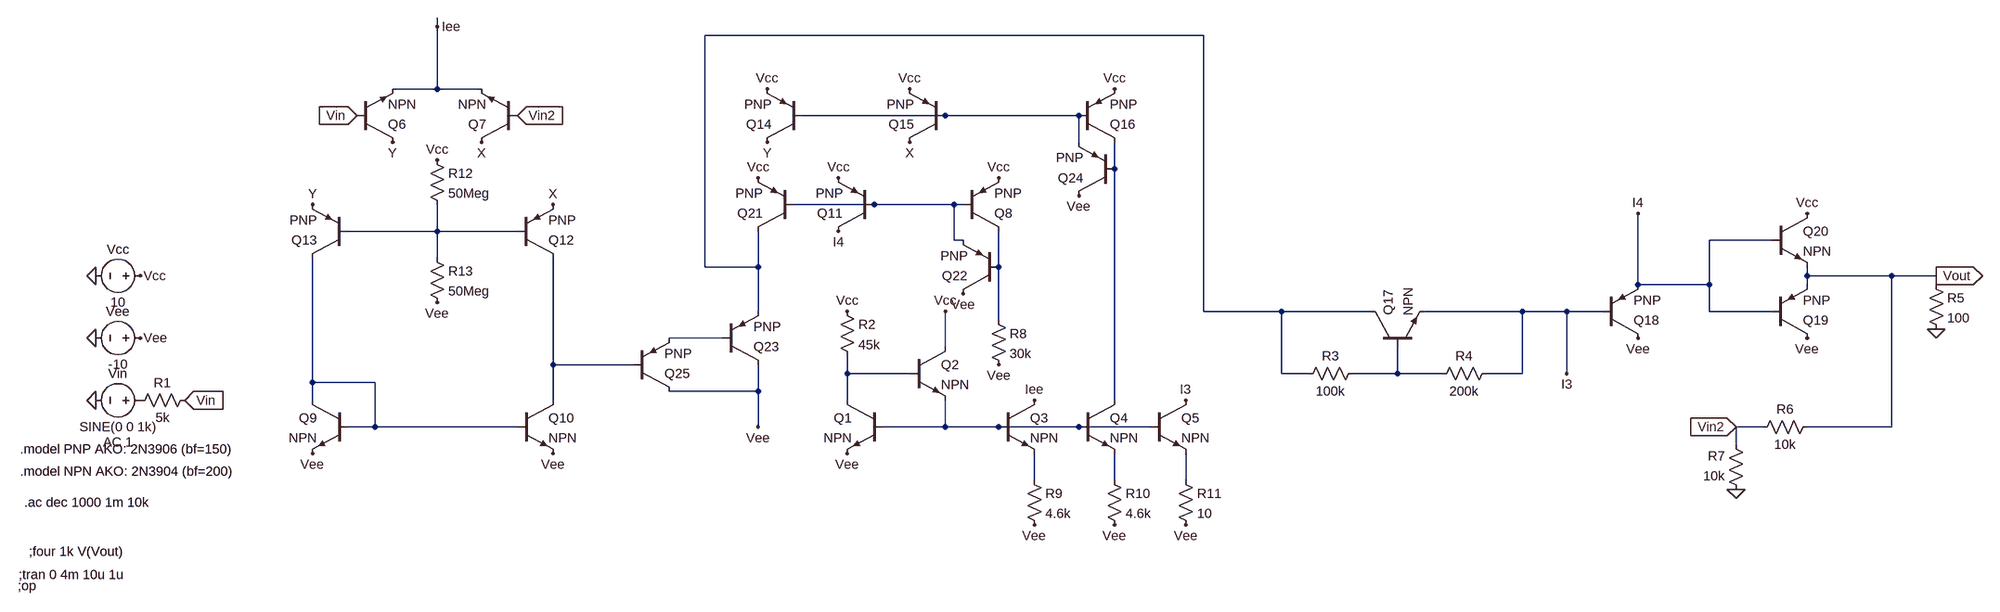
[diagram p0: schematic Electronic2_Project_phase2_Design_402101577.asc]
Electronic2_Project_phase2_Design_402101577.asc, the LTspice schematic file:
Version 4
SHEET 1 3920 1776
WIRE 832 64 832 48
WIRE 2272 80 1376 80
WIRE 832 176 832 64
WIRE 832 176 752 176
WIRE 912 176 832 176
WIRE 1808 224 1552 224
WIRE 2048 224 1808 224
WIRE 2048 272 2048 224
WIRE 2112 320 2112 272
WIRE 1680 384 1536 384
WIRE 1824 384 1680 384
WIRE 1840 384 1824 384
WIRE 832 432 832 384
WIRE 832 432 672 432
WIRE 976 432 832 432
WIRE 1824 448 1824 384
WIRE 1840 448 1824 448
WIRE 3504 448 3392 448
WIRE 832 480 832 432
WIRE 1376 496 1376 80
WIRE 1472 496 1472 432
WIRE 1472 496 1376 496
WIRE 1904 496 1904 432
WIRE 3568 512 3568 496
WIRE 3728 512 3568 512
WIRE 3808 512 3728 512
WIRE 3264 528 3264 400
WIRE 3392 528 3392 448
WIRE 3392 528 3264 528
WIRE 3568 528 3568 512
WIRE 3808 528 3808 512
WIRE 1472 576 1472 496
WIRE 2272 576 2272 80
WIRE 2624 576 2272 576
WIRE 2784 576 2624 576
WIRE 3056 576 2880 576
WIRE 3136 576 3056 576
WIRE 3200 576 3136 576
WIRE 3392 576 3392 528
WIRE 3504 576 3392 576
WIRE 1904 592 1904 496
WIRE 1408 624 1312 624
WIRE 1808 640 1808 576
WIRE 1040 672 1040 480
WIRE 1248 672 1040 672
WIRE 1632 688 1632 656
WIRE 1744 688 1632 688
WIRE 2624 688 2624 576
WIRE 2672 688 2624 688
WIRE 2832 688 2832 640
WIRE 2832 688 2752 688
WIRE 2912 688 2832 688
WIRE 3056 688 3056 576
WIRE 3056 688 2992 688
WIRE 3136 688 3136 576
WIRE 608 704 608 480
WIRE 720 704 608 704
WIRE 1472 720 1472 672
WIRE 1472 720 1312 720
WIRE 608 736 608 704
WIRE 1040 736 1040 672
WIRE 1632 736 1632 688
WIRE 2112 736 2112 320
WIRE 720 784 720 704
WIRE 720 784 672 784
WIRE 976 784 720 784
WIRE 1472 784 1472 720
WIRE 1808 784 1808 736
WIRE 1808 784 1696 784
WIRE 1904 784 1808 784
WIRE 2048 784 1904 784
WIRE 2176 784 2048 784
WIRE 3488 784 3440 784
WIRE 3728 784 3728 512
WIRE 3728 784 3568 784
WIRE 3440 816 3440 784
WIRE 1968 880 1968 832
WIRE 2112 880 2112 832
WIRE 2240 880 2240 832
FLAG 192 512 0
FLAG 192 624 0
FLAG 192 736 0
FLAG 272 512 Vcc
FLAG 272 624 Vee
FLAG 352 736 Vin
IOPIN 352 736 In
FLAG 1632 576 Vcc
FLAG 1808 576 Vcc
FLAG 1632 832 Vee
FLAG 2112 960 Vee
FLAG 2240 960 Vee
FLAG 688 224 Vin
IOPIN 688 224 In
FLAG 1968 736 Iee
FLAG 832 64 Iee
FLAG 608 832 Vee
FLAG 1040 832 Vee
FLAG 912 272 X
FLAG 1040 384 X
FLAG 752 272 Y
FLAG 608 384 Y
FLAG 1744 272 X
FLAG 1488 272 Y
FLAG 1488 176 Vcc
FLAG 1744 176 Vcc
FLAG 2112 176 Vcc
FLAG 3808 608 0
FLAG 3568 624 Vee
FLAG 3568 400 Vcc
FLAG 3264 624 Vee
FLAG 3136 688 I3
FLAG 2240 736 I3
FLAG 3808 512 Vout
IOPIN 3808 512 Out
FLAG 3440 896 0
FLAG 976 224 Vin2
IOPIN 976 224 In
FLAG 3440 784 Vin2
IOPIN 3440 784 In
FLAG 1840 544 Vee
FLAG 1904 672 Vee
FLAG 1968 960 Vee
FLAG 832 560 Vee
FLAG 832 304 Vcc
FLAG 1472 336 Vcc
FLAG 1616 336 Vcc
FLAG 1904 336 Vcc
FLAG 1472 784 Vee
FLAG 1616 432 I4
FLAG 3264 400 I4
FLAG 2048 368 Vee
SYMBOL voltage 288 512 R90
WINDOW 0 -32 56 VBottom 2
WINDOW 3 32 56 VTop 2
SYMATTR InstName Vcc
SYMATTR Value 10
SYMBOL voltage 288 624 R90
WINDOW 0 -32 56 VBottom 2
WINDOW 3 32 56 VTop 2
SYMATTR InstName Vee
SYMATTR Value -10
SYMBOL voltage 288 736 R90
WINDOW 0 -32 56 VBottom 2
WINDOW 3 32 56 VTop 2
WINDOW 123 60 56 VTop 2
WINDOW 39 0 0 Left 0
SYMATTR InstName Vin
SYMATTR Value SINE(0 0 1k)
SYMATTR Value2 AC 1
SYMBOL res 368 720 R90
WINDOW 0 0 56 VBottom 2
WINDOW 3 32 56 VTop 2
SYMATTR InstName R1
SYMATTR Value 5k
SYMBOL res 1616 560 R0
SYMATTR InstName R2
SYMATTR Value 45k
SYMBOL npn 1696 736 M0
SYMATTR InstName Q1
SYMBOL npn 1744 640 R0
SYMATTR InstName Q2
SYMBOL npn 1904 736 R0
SYMATTR InstName Q3
SYMBOL npn 2048 736 R0
SYMATTR InstName Q4
SYMBOL npn 2176 736 R0
SYMATTR InstName Q5
SYMBOL npn 688 272 M180
SYMATTR InstName Q6
SYMBOL npn 976 272 R180
SYMATTR InstName Q7
SYMBOL npn 672 736 M0
SYMATTR InstName Q9
SYMBOL npn 976 736 R0
SYMATTR InstName Q10
SYMBOL pnp 976 480 M180
SYMATTR InstName Q12
SYMBOL pnp 672 480 R180
SYMATTR InstName Q13
SYMBOL pnp 1552 272 R180
SYMATTR InstName Q14
SYMBOL pnp 1808 272 R180
SYMATTR InstName Q15
SYMBOL pnp 2048 272 M180
SYMATTR InstName Q16
SYMBOL npn 2784 640 R270
SYMATTR InstName Q17
SYMBOL res 2768 672 R90
WINDOW 0 0 56 VBottom 2
WINDOW 3 32 56 VTop 2
SYMATTR InstName R3
SYMATTR Value 100k
SYMBOL res 3008 672 R90
WINDOW 0 0 56 VBottom 2
WINDOW 3 32 56 VTop 2
SYMATTR InstName R4
SYMATTR Value 200k
SYMBOL pnp 3200 624 M180
SYMATTR InstName Q18
SYMBOL pnp 3504 624 M180
SYMATTR InstName Q19
SYMBOL npn 3504 400 R0
SYMATTR InstName Q20
SYMBOL res 3792 512 R0
SYMATTR InstName R5
SYMATTR Value 100
SYMBOL res 3584 768 R90
WINDOW 0 0 56 VBottom 2
WINDOW 3 32 56 VTop 2
SYMATTR InstName R6
SYMATTR Value 10k
SYMBOL res 3456 912 R180
WINDOW 0 36 76 Left 2
WINDOW 3 36 40 Left 2
SYMATTR InstName R7
SYMATTR Value 10k
SYMBOL pnp 1840 432 M180
SYMATTR InstName Q8
SYMBOL pnp 1680 432 R180
SYMATTR InstName Q11
SYMBOL pnp 1536 432 R180
SYMATTR InstName Q21
SYMBOL pnp 1904 544 R180
SYMATTR InstName Q22
SYMBOL res 1888 576 R0
SYMATTR InstName R8
SYMATTR Value 30k
SYMBOL res 1952 864 R0
SYMATTR InstName R9
SYMATTR Value 4.6k
SYMBOL res 2096 864 R0
SYMATTR InstName R10
SYMATTR Value 4.6k
SYMBOL res 2224 864 R0
SYMATTR InstName R11
SYMATTR Value 10
SYMBOL res 816 288 R0
SYMATTR InstName R12
SYMATTR Value 50Meg
SYMBOL res 816 464 R0
SYMATTR InstName R13
SYMATTR Value 50Meg
SYMBOL pnp 1408 672 M180
SYMATTR InstName Q23
SYMBOL pnp 2112 368 R180
SYMATTR InstName Q24
SYMBOL pnp 1248 720 M180
SYMATTR InstName Q25
TEXT 56 824 Left 2 !.model PNP AKO: 2N3906 (bf=150)
TEXT 56 864 Left 2 !.model NPN AKO: 2N3904 (bf=200)
TEXT 64 920 Left 2 !.ac dec 1000 1m 10k
TEXT 54 1050 Left 2 !;tran 0 4m 10u 1u
TEXT 72 1008 Left 2 !;four 1k V(Vout)
TEXT 52 1070 Left 2 !;op

The netlist it stands for:
* Electronic2_Project_phase2_Design_402101577.asc
Vcc Vcc 0 10
Vee Vee 0 -10
Vin P001 0 SINE(0 0 1k) AC 1
R1 Vin P001 5k
R2 Vcc N009 45k
Q1 N009 N012 Vee 0 NPN
Q2 Vcc N009 N012 0 NPN
Q3 Iee N012 N013 0 NPN
Q4 N003 N012 N014 0 NPN
Q5 I3 N012 N015 0 NPN
Q6 Y Vin Iee 0 NPN
Q7 X Vin2 Iee 0 NPN
Q9 N011 N011 Vee 0 NPN
Q10 N008 N011 Vee 0 NPN
Q12 N008 N005 X 0 PNP
Q13 N011 N005 Y 0 PNP
Q14 Y N002 Vcc 0 PNP
Q15 X N002 Vcc 0 PNP
Q16 N003 N002 Vcc 0 PNP
Q17 N001 N010 I3 0 NPN
R3 N010 N001 100k
R4 I3 N010 200k
Q18 Vee I3 I4 0 PNP
Q19 Vee I4 Vout 0 PNP
Q20 Vcc I4 Vout 0 NPN
R5 Vout 0 100
R6 Vout Vin2 10k
R7 0 Vin2 10k
Q8 N006 N004 Vcc 0 PNP
Q11 I4 N004 Vcc 0 PNP
Q21 N001 N004 Vcc 0 PNP
Q22 Vee N006 N004 0 PNP
R8 N006 Vee 30k
R9 N013 Vee 4.6k
R10 N014 Vee 4.6k
R11 N015 Vee 10
R12 Vcc N005 50Meg
R13 N005 Vee 50Meg
Q23 Vee N007 N001 0 PNP
Q24 Vee N003 N002 0 PNP
Q25 Vee N008 N007 0 PNP
.model NPN NPN
.model PNP PNP
.lib standard.bjt
.model PNP AKO: 2N3906 (bf=150)
.model NPN AKO: 2N3904 (bf=200)
.ac dec 1000 1m 10k
;tran 0 4m 10u 1u
;four 1k V(Vout)
;op
.backanno
.end